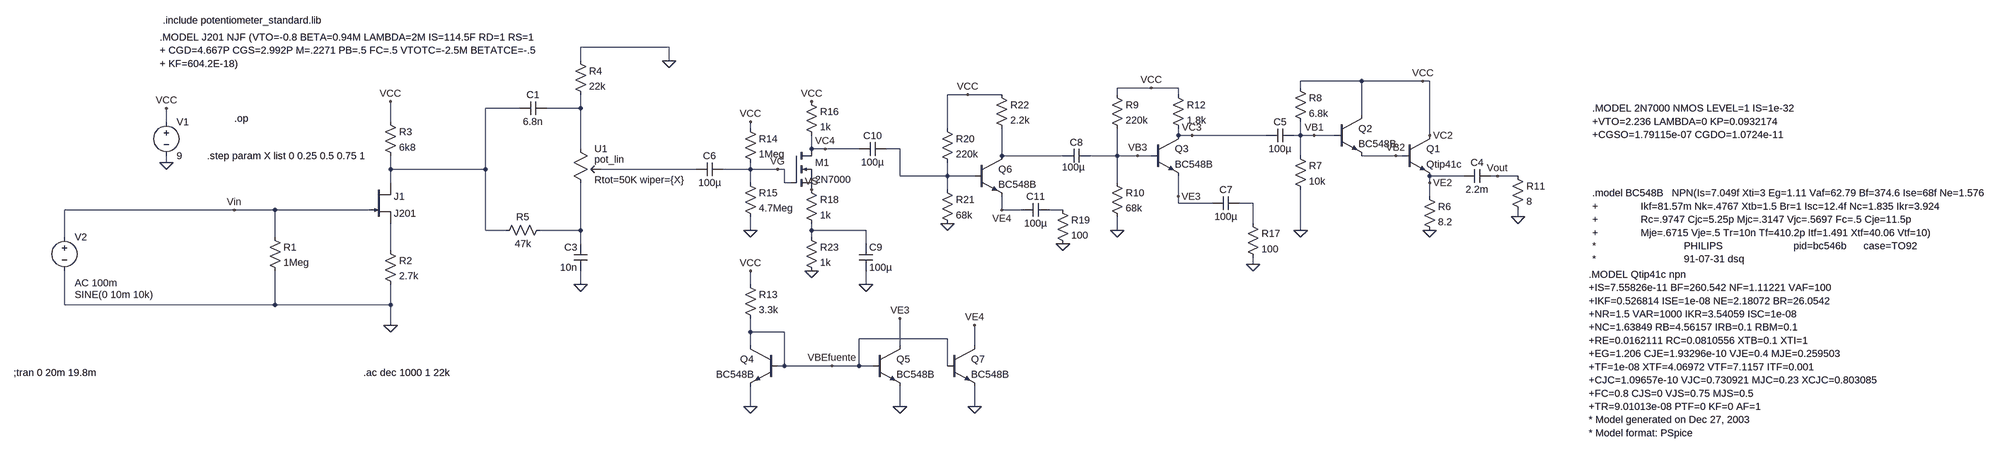
[diagram p0: schematic CircuitoCompleto.asc]
CircuitoCompleto.asc, the LTspice schematic file:
Version 4
SHEET 1 5808 1124
WIRE 976 80 768 80
WIRE 768 112 768 80
WIRE 976 112 976 80
WIRE 2608 160 2464 160
WIRE 2752 160 2608 160
WIRE 2768 160 2752 160
WIRE 2112 176 2032 176
WIRE 2176 176 2112 176
WIRE 2464 176 2464 160
WIRE 1680 192 1632 192
WIRE 1760 192 1680 192
WIRE 2032 192 2032 176
WIRE 2176 192 2176 176
WIRE 624 224 544 224
WIRE 768 224 768 192
WIRE 768 224 688 224
WIRE 2608 240 2608 160
WIRE -208 256 -208 224
WIRE 320 256 320 208
WIRE 1168 272 1168 256
WIRE 1632 272 1632 192
WIRE 2176 288 2176 272
WIRE 2208 288 2176 288
WIRE 2384 288 2208 288
WIRE 2464 288 2464 256
WIRE 2464 288 2448 288
WIRE 2496 288 2464 288
WIRE 2544 288 2496 288
WIRE 2768 288 2768 160
WIRE 768 320 768 224
WIRE 1312 320 1312 288
WIRE 1344 320 1312 320
WIRE 1424 320 1344 320
WIRE 1520 320 1488 320
WIRE 1760 336 1760 272
WIRE 1904 336 1760 336
WIRE 2032 336 2032 272
WIRE 2032 336 1968 336
WIRE 2080 336 2032 336
WIRE 2112 336 2080 336
WIRE 2464 336 2464 288
WIRE 2688 336 2608 336
WIRE 2704 336 2688 336
WIRE -208 352 -208 336
WIRE 320 368 320 336
WIRE 544 368 544 224
WIRE 544 368 320 368
WIRE 1040 368 816 368
WIRE 1168 368 1168 352
WIRE 1168 368 1104 368
WIRE 1232 368 1168 368
WIRE 1248 368 1232 368
WIRE 1520 384 1520 320
WIRE 1632 384 1632 352
WIRE 1632 384 1520 384
WIRE 1696 384 1632 384
WIRE 2848 384 2768 384
WIRE 2928 384 2912 384
WIRE 2976 384 2928 384
WIRE 320 400 320 368
WIRE 1168 400 1168 368
WIRE 1248 400 1248 368
WIRE 1264 400 1248 400
WIRE 2032 400 2032 336
WIRE 2768 400 2768 384
WIRE 1632 416 1632 384
WIRE 2176 432 2176 384
WIRE 2768 432 2768 400
WIRE 2176 448 2176 432
WIRE 2256 448 2176 448
WIRE 2352 448 2320 448
WIRE -48 464 -448 464
WIRE 48 464 -48 464
WIRE 272 464 48 464
WIRE 1760 464 1760 432
WIRE 1808 464 1760 464
WIRE 1904 464 1872 464
WIRE 2976 480 2976 464
WIRE 2352 496 2352 448
WIRE 544 512 544 368
WIRE 592 512 544 512
WIRE 768 512 768 400
WIRE 768 512 672 512
WIRE 1168 512 1168 480
WIRE 1312 512 1312 496
WIRE 1440 512 1312 512
WIRE 2032 512 2032 480
WIRE 2464 512 2464 416
WIRE -448 528 -448 464
WIRE 48 528 48 464
WIRE 1312 528 1312 512
WIRE 768 544 768 512
WIRE 1440 544 1440 512
WIRE 320 560 320 496
WIRE 2352 592 2352 576
WIRE 768 640 768 608
WIRE 1168 640 1168 608
WIRE 1440 640 1440 608
WIRE -448 688 -448 608
WIRE 48 688 48 608
WIRE 48 688 -448 688
WIRE 320 688 320 640
WIRE 320 688 48 688
WIRE 320 736 320 688
WIRE 1168 752 1168 720
WIRE 1248 752 1168 752
WIRE 1632 768 1424 768
WIRE 1168 784 1168 752
WIRE 1520 784 1520 720
WIRE 1696 784 1696 736
WIRE 1248 832 1248 752
WIRE 1248 832 1232 832
WIRE 1360 832 1248 832
WIRE 1424 832 1424 768
WIRE 1424 832 1360 832
WIRE 1456 832 1424 832
WIRE 1632 832 1632 768
WIRE 1168 928 1168 880
WIRE 1520 928 1520 880
WIRE 1696 928 1696 880
FLAG 320 736 0
FLAG -208 352 0
FLAG -208 224 VCC
FLAG 320 208 VCC
FLAG -48 464 Vin
FLAG 768 640 0
FLAG 2752 160 VCC
FLAG 2768 512 0
FLAG 2464 512 0
FLAG 2688 336 VB2
FLAG 2496 288 VB1
FLAG 2768 400 VE2
FLAG 2032 512 0
FLAG 2112 176 VCC
FLAG 2080 336 VB3
FLAG 2976 480 0
FLAG 2768 288 VC2
FLAG 2208 288 VC3
FLAG 2176 432 VE3
FLAG 1168 928 0
FLAG 1168 608 VCC
FLAG 1168 256 VCC
FLAG 1168 512 0
FLAG 1312 208 VCC
FLAG 1344 320 VC4
FLAG 1520 928 0
FLAG 1520 720 VE3
FLAG 2352 592 0
FLAG 1232 368 VG
FLAG 1312 416 VS
FLAG 1440 640 0
FLAG 1360 832 VBEfuente
FLAG 1904 544 0
FLAG 1632 496 0
FLAG 1680 192 VCC
FLAG 1760 464 VE4
FLAG 1696 928 0
FLAG 1696 736 VE4
FLAG 1312 608 0
FLAG 2928 384 Vout
FLAG 976 112 0
SYMBOL njf 272 400 R0
SYMATTR InstName J1
SYMATTR Value J201
SYMBOL res 32 512 R0
SYMATTR InstName R1
SYMATTR Value 1Meg
SYMBOL res 304 544 R0
SYMATTR InstName R2
SYMATTR Value 2.7k
SYMBOL res 304 240 R0
SYMATTR InstName R3
SYMATTR Value 6k8
SYMBOL voltage -208 240 R0
SYMATTR InstName V1
SYMATTR Value 9
SYMBOL voltage -448 512 R0
WINDOW 3 24 152 Left 2
WINDOW 123 24 124 Left 2
WINDOW 39 0 0 Left 2
SYMATTR Value SINE(0 10m 10k)
SYMATTR Value2 AC 100m
SYMATTR InstName V2
SYMBOL cap 688 208 R90
WINDOW 0 0 32 VBottom 2
WINDOW 3 32 32 VTop 2
SYMATTR InstName C1
SYMATTR Value 6.8n
SYMBOL cap 784 608 R180
WINDOW 0 24 56 Left 2
WINDOW 3 24 8 Left 2
SYMATTR InstName C3
SYMATTR Value 10n
SYMBOL res 752 96 R0
SYMATTR InstName R4
SYMATTR Value 22k
SYMBOL res 688 496 R90
WINDOW 0 0 56 VBottom 2
WINDOW 3 32 56 VTop 2
SYMATTR InstName R5
SYMATTR Value 47k
SYMBOL potentiometer_standard 752 304 R0
SYMATTR InstName U1
SYMATTR Value Rtot=50K wiper={X}
SYMATTR SpiceLine ""
SYMBOL npn 2704 288 R0
SYMATTR InstName Q1
SYMATTR Value Qtip41c
SYMBOL npn 2544 240 R0
SYMATTR InstName Q2
SYMATTR Value BC548B
SYMBOL res 2752 416 R0
SYMATTR InstName R6
SYMATTR Value 8.2
SYMBOL res 2448 320 R0
SYMATTR InstName R7
SYMATTR Value 10k
SYMBOL res 2448 160 R0
SYMATTR InstName R8
SYMATTR Value 6.8k
SYMBOL npn 2112 288 R0
SYMATTR InstName Q3
SYMATTR Value BC548B
SYMBOL res 2016 176 R0
SYMATTR InstName R9
SYMATTR Value 220k
SYMBOL res 2016 384 R0
SYMATTR InstName R10
SYMATTR Value 68k
SYMBOL res 2960 368 R0
SYMATTR InstName R11
SYMATTR Value 8
SYMBOL cap 2848 400 R270
WINDOW 0 32 32 VTop 2
WINDOW 3 0 32 VBottom 2
SYMATTR InstName C4
SYMATTR Value 2.2m
SYMBOL cap 2448 272 R90
WINDOW 0 0 32 VBottom 2
WINDOW 3 32 32 VTop 2
SYMATTR InstName C5
SYMATTR Value 100µ
SYMBOL res 2160 176 R0
SYMATTR InstName R12
SYMATTR Value 1.8k
SYMBOL npn 1232 784 M0
SYMATTR InstName Q4
SYMATTR Value BC548B
SYMBOL res 1152 624 R0
SYMATTR InstName R13
SYMATTR Value 3.3k
SYMBOL res 1152 256 R0
SYMATTR InstName R14
SYMATTR Value 1Meg
SYMBOL res 1152 384 R0
SYMATTR InstName R15
SYMATTR Value 4.7Meg
SYMBOL res 1296 192 R0
SYMATTR InstName R16
SYMATTR Value 1k
SYMBOL cap 1104 352 R90
WINDOW 0 0 32 VBottom 2
WINDOW 3 32 32 VTop 2
SYMATTR InstName C6
SYMATTR Value 100µ
SYMBOL npn 1456 784 R0
SYMATTR InstName Q5
SYMATTR Value BC548B
SYMBOL cap 2256 464 R270
WINDOW 0 32 32 VTop 2
WINDOW 3 0 32 VBottom 2
SYMATTR InstName C7
SYMATTR Value 100µ
SYMBOL res 2336 480 R0
SYMATTR InstName R17
SYMATTR Value 100
SYMBOL cap 1904 352 R270
WINDOW 0 32 32 VTop 2
WINDOW 3 5 25 VBottom 2
SYMATTR InstName C8
SYMATTR Value 100µ
SYMBOL nmos 1264 320 R0
SYMATTR InstName M1
SYMATTR Value 2N7000
SYMBOL res 1296 400 R0
SYMATTR InstName R18
SYMATTR Value 1k
SYMBOL cap 1424 544 R0
SYMATTR InstName C9
SYMATTR Value 100µ
SYMBOL cap 1424 336 R270
WINDOW 0 32 32 VTop 2
WINDOW 3 0 32 VBottom 2
SYMATTR InstName C10
SYMATTR Value 100µ
SYMBOL npn 1696 336 R0
SYMATTR InstName Q6
SYMATTR Value BC548B
SYMBOL cap 1808 480 R270
WINDOW 0 32 32 VTop 2
WINDOW 3 0 32 VBottom 2
SYMATTR InstName C11
SYMATTR Value 100µ
SYMBOL res 1888 448 R0
SYMATTR InstName R19
SYMATTR Value 100
SYMBOL res 1616 256 R0
SYMATTR InstName R20
SYMATTR Value 220k
SYMBOL res 1616 400 R0
SYMATTR InstName R21
SYMATTR Value 68k
SYMBOL res 1744 176 R0
SYMATTR InstName R22
SYMATTR Value 2.2k
SYMBOL npn 1632 784 R0
SYMATTR InstName Q7
SYMATTR Value BC548B
SYMBOL res 1296 512 R0
SYMATTR InstName R23
SYMATTR Value 1k
TEXT -224 56 Left 2 !.MODEL J201 NJF (VTO=-0.8 BETA=0.94M LAMBDA=2M IS=114.5F RD=1 RS=1\n+ CGD=4.667P CGS=2.992P M=.2271 PB=.5 FC=.5 VTOTC=-2.5M BETATCE=-.5\n+ KF=604.2E-18)
TEXT -48 248 Left 2 !.op
TEXT -216 16 Left 2 !.include potentiometer_standard.lib
TEXT -112 336 Left 2 !.step param X list 0 0.25 0.5 0.75 1
TEXT 3328 616 Left 2 !.MODEL Qtip41c npn\n+IS=7.55826e-11 BF=260.542 NF=1.11221 VAF=100\n+IKF=0.526814 ISE=1e-08 NE=2.18072 BR=26.0542\n+NR=1.5 VAR=1000 IKR=3.54059 ISC=1e-08\n+NC=1.63849 RB=4.56157 IRB=0.1 RBM=0.1\n+RE=0.0162111 RC=0.0810556 XTB=0.1 XTI=1\n+EG=1.206 CJE=1.93296e-10 VJE=0.4 MJE=0.259503\n+TF=1e-08 XTF=4.06972 VTF=7.1157 ITF=0.001\n+CJC=1.09657e-10 VJC=0.730921 MJC=0.23 XCJC=0.803085\n+FC=0.8 CJS=0 VJS=0.75 MJS=0.5\n+TR=9.01013e-08 PTF=0 KF=0 AF=1\n* Model generated on Dec 27, 2003\n* Model format: PSpice
TEXT 3336 424 Left 2 !.model BC548B   NPN(Is=7.049f Xti=3 Eg=1.11 Vaf=62.79 Bf=374.6 Ise=68f Ne=1.576\n+               Ikf=81.57m Nk=.4767 Xtb=1.5 Br=1 Isc=12.4f Nc=1.835 Ikr=3.924\n+               Rc=.9747 Cjc=5.25p Mjc=.3147 Vjc=.5697 Fc=.5 Cje=11.5p\n+               Mje=.6715 Vje=.5 Tr=10n Tf=410.2p Itf=1.491 Xtf=40.06 Vtf=10)\n*                               PHILIPS                         pid=bc546b      case=TO92\n*                               91-07-31 dsq
TEXT 3336 224 Left 2 !.MODEL 2N7000 NMOS LEVEL=1 IS=1e-32\n+VTO=2.236 LAMBDA=0 KP=0.0932174\n+CGSO=1.79115e-07 CGDO=1.0724e-11
TEXT -568 848 Left 2 !;tran 0 20m 19.8m
TEXT 256 848 Left 2 !.ac dec 1000 1 22k

The netlist it stands for:
* CircuitoCompleto.asc
J1 N001 Vin N010 J201
R1 Vin 0 1Meg
R2 N010 0 2.7k
R3 VC2 N001 6k8
V1 VC2 0 9
V2 Vin 0 SINE(0 10m 10k) AC 100m
C1 N002 N001 6.8n
C3 0 N008 10n
R4 0 N002 22k
R5 N008 N001 47k
XU1 N002 N008 N005 pot_lin Rtot=50K wiper={X}  ; pins A B C
Q1 VC2 VB2 VE2 0 Qtip41c
Q2 VC2 VB1 VB2 0 BC548B
R6 VE2 0 8.2
R7 VB1 0 10k
R8 VC2 VB1 6.8k
Q3 VC3 VB3 VE3 0 BC548B
R9 VC2 VB3 220k
R10 VB3 0 68k
R11 Vout 0 8
C4 VE2 Vout 2.2m
C5 VB1 VC3 100µ
R12 VC2 VC3 1.8k
Q4 VBEfuente VBEfuente 0 0 BC548B
R13 VC2 VBEfuente 3.3k
R14 VC2 VG 1Meg
R15 VG 0 4.7Meg
R16 VC2 VC4 1k
C6 VG N005 100µ
Q5 VE3 VBEfuente 0 0 BC548B
C7 VE3 N006 100µ
R17 N006 0 100
C8 N004 VB3 100µ
M1 VC4 VG VS VS 2N7000
R18 VS N009 1k
C9 N009 0 100µ
C10 VC4 N003 100µ
Q6 N004 N003 VE4 0 BC548B
C11 VE4 N007 100µ
R19 N007 0 100
R20 VC2 N003 220k
R21 N003 0 68k
R22 VC2 N004 2.2k
Q7 VE4 VBEfuente 0 0 BC548B
R23 N009 0 1k
.model NPN NPN
.model PNP PNP
.lib standard.bjt
.model NJF NJF
.model PJF PJF
.lib standard.jft
.model NMOS NMOS
.model PMOS PMOS
.lib standard.mos
.MODEL J201 NJF (VTO=-0.8 BETA=0.94M LAMBDA=2M IS=114.5F RD=1 RS=1
+ CGD=4.667P CGS=2.992P M=.2271 PB=.5 FC=.5 VTOTC=-2.5M BETATCE=-.5
+ KF=604.2E-18)
.op
.include potentiometer_standard.lib
.step param X list 0 0.25 0.5 0.75 1
.MODEL Qtip41c npn
+IS=7.55826e-11 BF=260.542 NF=1.11221 VAF=100
+IKF=0.526814 ISE=1e-08 NE=2.18072 BR=26.0542
+NR=1.5 VAR=1000 IKR=3.54059 ISC=1e-08
+NC=1.63849 RB=4.56157 IRB=0.1 RBM=0.1
+RE=0.0162111 RC=0.0810556 XTB=0.1 XTI=1
+EG=1.206 CJE=1.93296e-10 VJE=0.4 MJE=0.259503
+TF=1e-08 XTF=4.06972 VTF=7.1157 ITF=0.001
+CJC=1.09657e-10 VJC=0.730921 MJC=0.23 XCJC=0.803085
+FC=0.8 CJS=0 VJS=0.75 MJS=0.5
+TR=9.01013e-08 PTF=0 KF=0 AF=1
* Model generated on Dec 27, 2003
* Model format: PSpice
.model BC548B   NPN(Is=7.049f Xti=3 Eg=1.11 Vaf=62.79 Bf=374.6 Ise=68f Ne=1.576
+               Ikf=81.57m Nk=.4767 Xtb=1.5 Br=1 Isc=12.4f Nc=1.835 Ikr=3.924
+               Rc=.9747 Cjc=5.25p Mjc=.3147 Vjc=.5697 Fc=.5 Cje=11.5p
+               Mje=.6715 Vje=.5 Tr=10n Tf=410.2p Itf=1.491 Xtf=40.06 Vtf=10)
*                               PHILIPS                         pid=bc546b      case=TO92
*                               91-07-31 dsq
.MODEL 2N7000 NMOS LEVEL=1 IS=1e-32
+VTO=2.236 LAMBDA=0 KP=0.0932174
+CGSO=1.79115e-07 CGDO=1.0724e-11
;tran 0 20m 19.8m
.ac dec 1000 1 22k
.backanno
.end